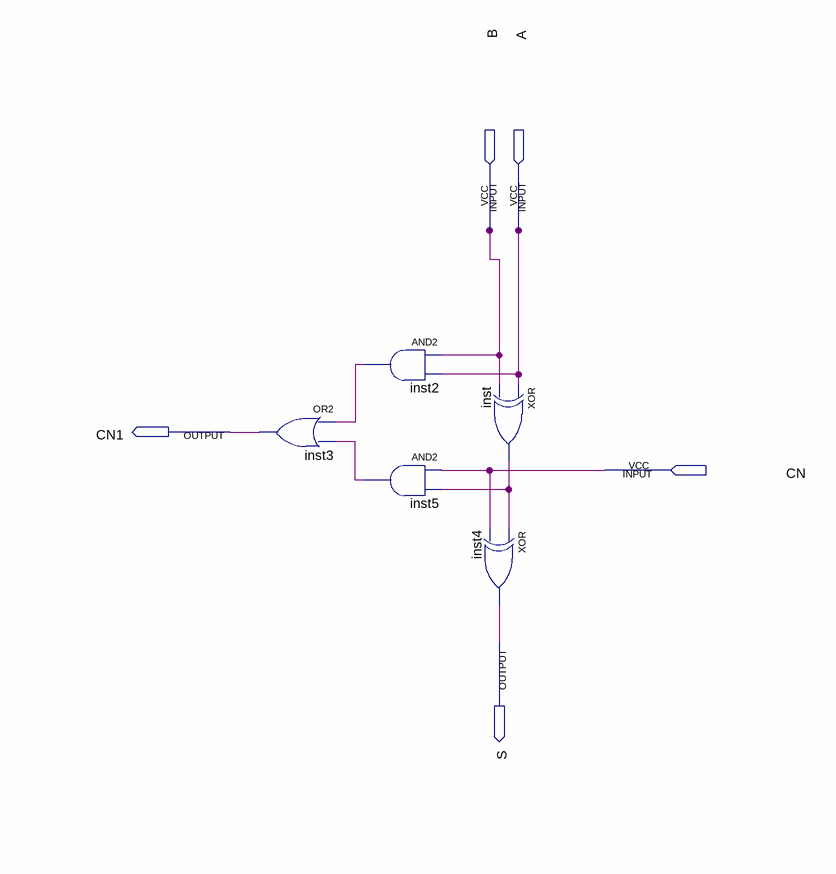
[diagram p0: schematic sheet]
// Quartus schematic eos_halfadder.bdf as structural Verilog: 5 symbols, 5 pins
module eos_halfadder (
  input  B,
  input  A,
  input  CN,
  output CN1,
  output S
);

  wire inst2_out, inst5_out, inst_out;

  or inst3 (CN1, inst2_out, inst5_out);
  and inst2 (inst2_out, B, A);
  and inst5 (inst5_out, CN, inst_out);
  xor inst (inst_out, A, B);
  xor inst4 (S, inst_out, CN);
endmodule
